# EAGLE design street_lamp_controller (EAGLE 7.2.0)
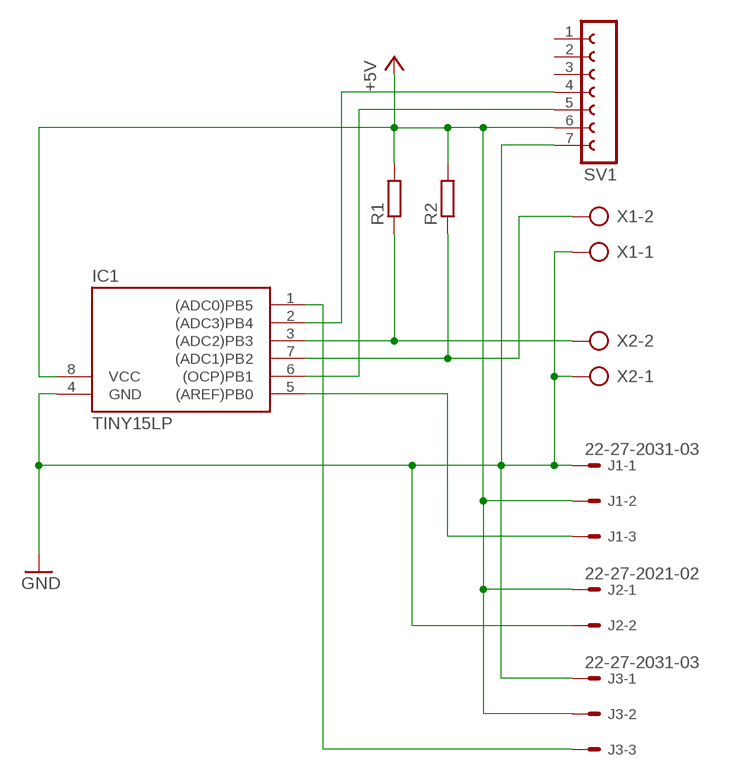
[diagram p0: schematic, sheet 1]

## Parts
IC1  TINY15LP  [DIL08]
J1  22-27-2031-03  [6410-03]
J2  22-27-2021-02  [6410-02]
J3  22-27-2031-03  [6410-03]
R1  R-EU_0204/5  [0204/5]
R2  R-EU_0204/5  [0204/5]
SV1  FE07-1  [FE07]
X1  AK300/2  [AK300/2]
X2  AK300/2  [AK300/2]

## Nets
+5V: IC1.8(VCC) J1.2 J2.1 J3.2 R1.2 R2.2 SV1.6
GND: IC1.4(GND) J1.1 J2.2 J3.1 SV1.7 X1.1 X2.1
N$1: IC1.6((OCP)PB1) SV1.5
N$2: IC1.7((ADC1)PB2) R2.1 X1.2
N$3: IC1.3((ADC2)PB3) R1.1 X2.2
N$4: IC1.5((AREF)PB0) J1.3
N$5: IC1.2((ADC3)PB4) SV1.4
N$6: IC1.1((ADC0)PB5) J3.3
Unconnected: SV1.1 SV1.2 SV1.3

## Library data of the parts
IC1 = atmel:TINY15L: MICROCONTROLLER 2.7 V 1 Kbytes FLASH 64 bytes EEPROM 4-channel 10 bit ADC; OC_FARNELL: unknown; OC_NEWARK: unknown
J1 J3 = con-molex:22-?-03: CONNECTOR wire to board 2.54 mm (.1 inch) pitch header; OC_FARNELL: unknown; OC_NEWARK: unknown
J2 = con-molex:22-?-02: CONNECTOR wire to board 2.54 mm (.1 inch) pitch header; OC_FARNELL: unknown; OC_NEWARK: unknown
R1 R2 = resistor:R-EU_: RESISTOR, European symbol
SV1 = con-lsta:FE07-1: FEMALE HEADER; OC_FARNELL: unknown; OC_NEWARK: unknown
X1 X2 = con-ptr500:AK300/2: CONNECTOR; OC_FARNELL: unknown; OC_NEWARK: unknown

## Board
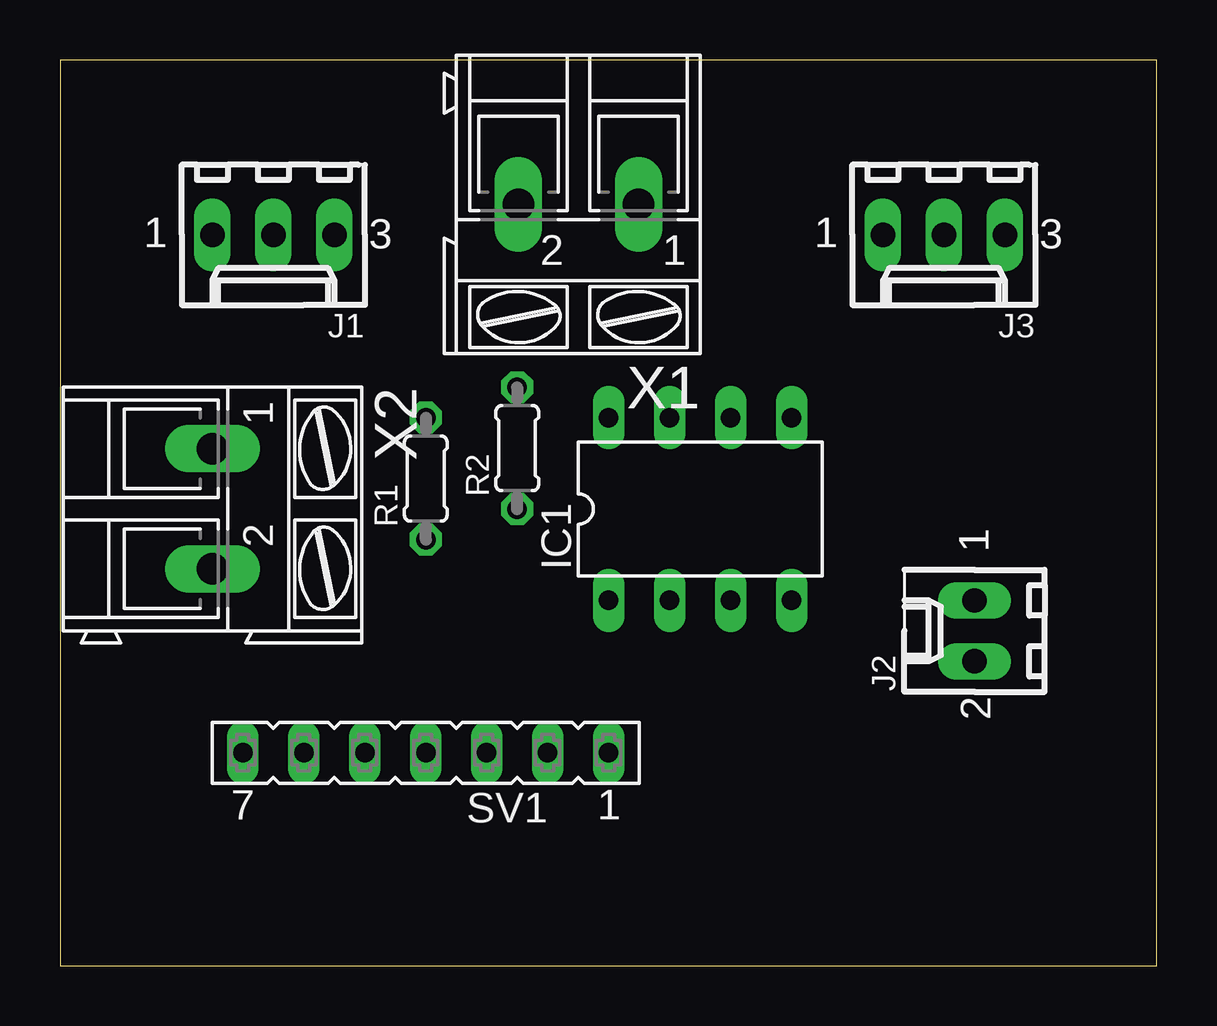
[diagram p1: board, top side]
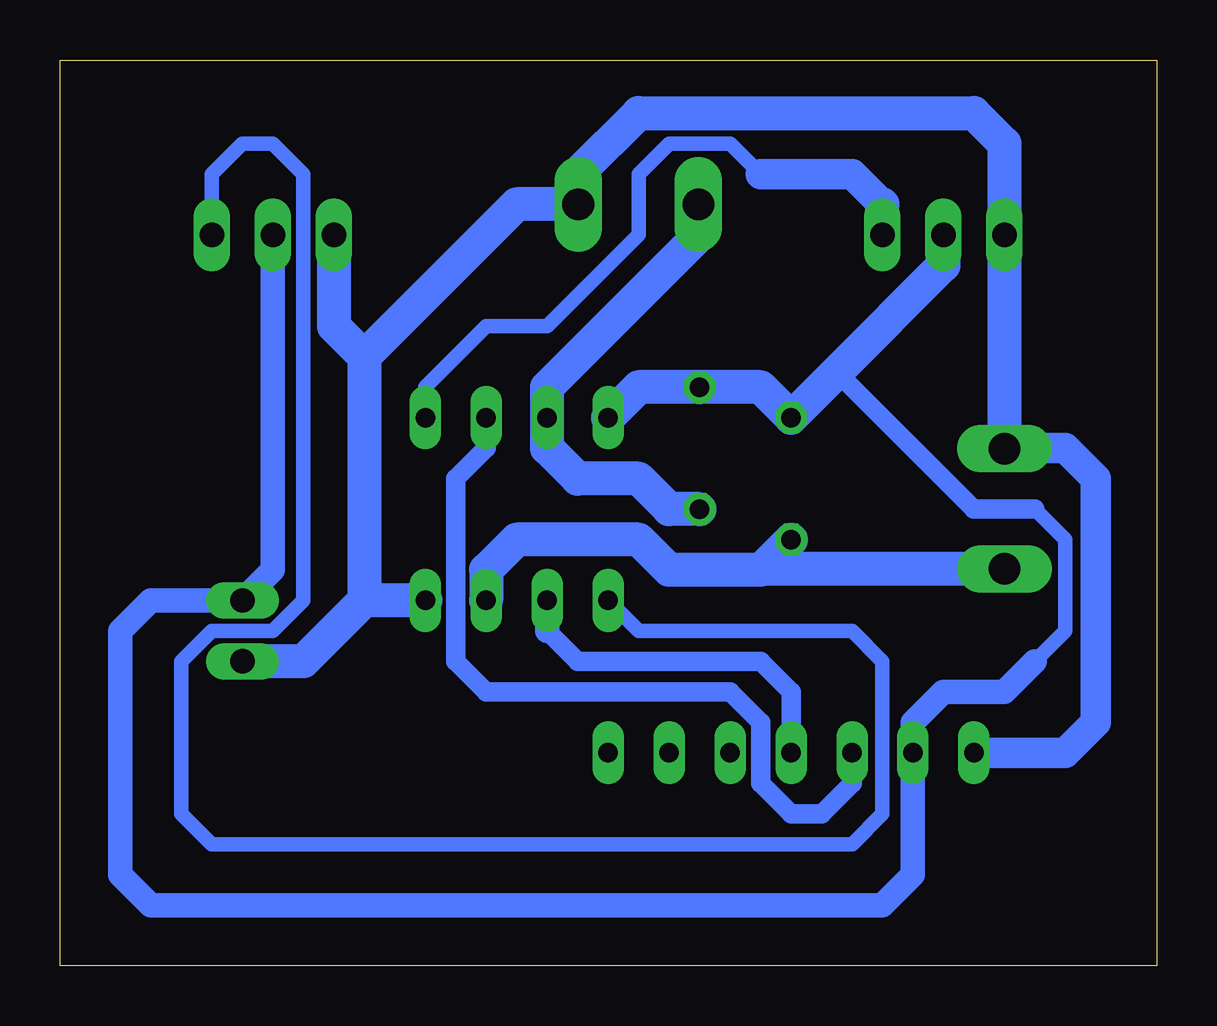
[diagram p2: board, bottom side, seen from below]

Size 45.7 x 37.77 mm. Coordinates in mm from the lower left corner, seen from the top.
Outline: 0,0 45.7,0 45.7,37.77 0,37.77 0,0
Copper layers (1*16): Top 0.035mm / dielectric 1.5mm / Bottom 0.035mm
Design rules "default": minimum track width 10mil, minimum drill 24mil, track to track 8mil, track to pad 8mil, pad to pad 8mil, via to via 8mil, smd to smd 8mil, copper to edge 40mil, drill to drill 8mil, minimum pad ring 10mil, minimum via ring 8mil, stop-mask expansion 4mil, vias tented up to drill 0mil, thermal gap 10mil

### Footprints (pad centres in the part's own frame; a part is rotated, then mirrored left to right if it is on the bottom)
DIL08 = drill 0.813 long: 1 -3.81,-3.81; 2 -1.27,-3.81; 3 1.27,-3.81; 4 3.81,-3.81; 5 3.81,3.81; 6 1.27,3.81; 7 -1.27,3.81; 8 -3.81,3.81
6410-03 = drill 1.016 long: 1 2.54,0; 2 0,0; 3 -2.54,0
6410-02 = drill 1.016 long: 1 1.27,0; 2 -1.27,0
0204/5 = drill 0.813 octagon: 1 -2.54,0; 2 2.54,0
FE07 = drill 0.813 long: 1 -7.62,0; 2 -5.08,0; 3 -2.54,0; 4 0,0; 5 2.54,0; 6 5.08,0; 7 7.62,0
AK300/2 = drill 1.321 long: 1 -2.515,0; 2 2.489,0

### Placement (x,y rotation side)
IC1  26.67,19.05 0 top
J1  8.89,30.48 180 top
J2  38.1,13.97 90 top
J3  36.83,30.48 180 top
R1  15.24,20.32 90 top
R2  19.05,21.59 90 top
SV1  15.24,8.89 180 top
X1  21.59,31.75 180 top
X2  6.35,19.05 270 top

### Tracks (layer width: path | path; a pad name or v marks a point on that pad's centre or on a via)
+5V
  Bottom 0.61: 5.08,12.7 3.81,13.97 3.81,17.78 5.08,19.05
  Bottom 0.813: 5.08,19.05 7.62,19.05 13.34,24.77
  Bottom 1.016: 5.08,12.7 6.35,11.43 8.89,11.43 10.16,10.16 SV1.6 10.16,3.81 11.43,2.54 41.91,2.54 43.18,3.81 43.18,13.97 41.91,15.24 J2.1 36.83,16.51 J3.2
  Bottom 1.422: IC1.8 21.59,24.13 R2.2 16.51,24.13 R1.2 13.34,24.77 8.89,29.21 J1.2
GND
  Bottom 1.27: SV1.7 3.81,8.89 2.54,10.16 2.54,20.32 3.81,21.59 6.33,21.59
  Bottom 1.422: 6.33,21.59 X2.1 J1.1 6.35,34.29 7.62,35.56 21.59,35.56 24.11,33.05 X1.1 26.67,31.75 33.02,25.4 | IC1.4 33.02,15.24 | 33.02,25.4 33.02,15.24 | J3.1 34.29,26.67 33.02,25.4 | 33.02,15.24 35.56,12.7 J2.2
N$1
  Bottom 0.813: SV1.5 12.7,7.62 13.97,6.35 15.24,6.35 16.51,7.62 16.51,10.16 17.78,11.43 27.94,11.43 29.21,12.7 29.21,20.32 27.94,21.59 IC1.6
N$2
  Bottom 1.422: R2.1 20.32,19.05 21.59,20.32 24.13,20.32 25.4,21.59 IC1.7 25.4,24.13 19.05,30.48 19.05,31.7 X1.2
N$3
  Bottom 1.422: R1.1 16.46,16.56 | IC1.3 27.94,16.51 26.67,17.78 21.59,17.78 20.32,16.51 16.51,16.51 16.46,16.56 | X2.2 16.46,16.56
N$4
  Bottom 0.61: 16.51,33.02 17.78,34.29 20.32,34.29 21.59,33.02 21.59,30.48 25.4,26.67 27.94,26.67 30.48,24.13 IC1.5
  Bottom 1.27: 11.43,31.75 12.7,33.02 16.51,33.02
  Bottom 1.422: J1.3 11.43,31.75
N$5
  Bottom 0.813: 25.4,13.97 24.13,12.7 16.51,12.7 15.24,11.43 SV1.4
  Bottom 1.016: IC1.2 25.4,13.97
N$6
  Bottom 0.61: IC1.1 21.59,13.97 12.7,13.97 11.43,12.7 11.43,6.35 12.7,5.08 39.37,5.08 40.64,6.35 40.64,12.7 39.37,13.97 36.83,13.97 35.56,15.24 35.56,33.02 36.83,34.29 38.1,34.29 39.37,33.02 J3.3